# EasyEDA schematic Vehicle Accident Detection.json
TITLE: Sheet_1; REV: 1.0; Date: 2020-03-09; Sheet: 1/1; Drawn By: abhig0209; Company: Your Company
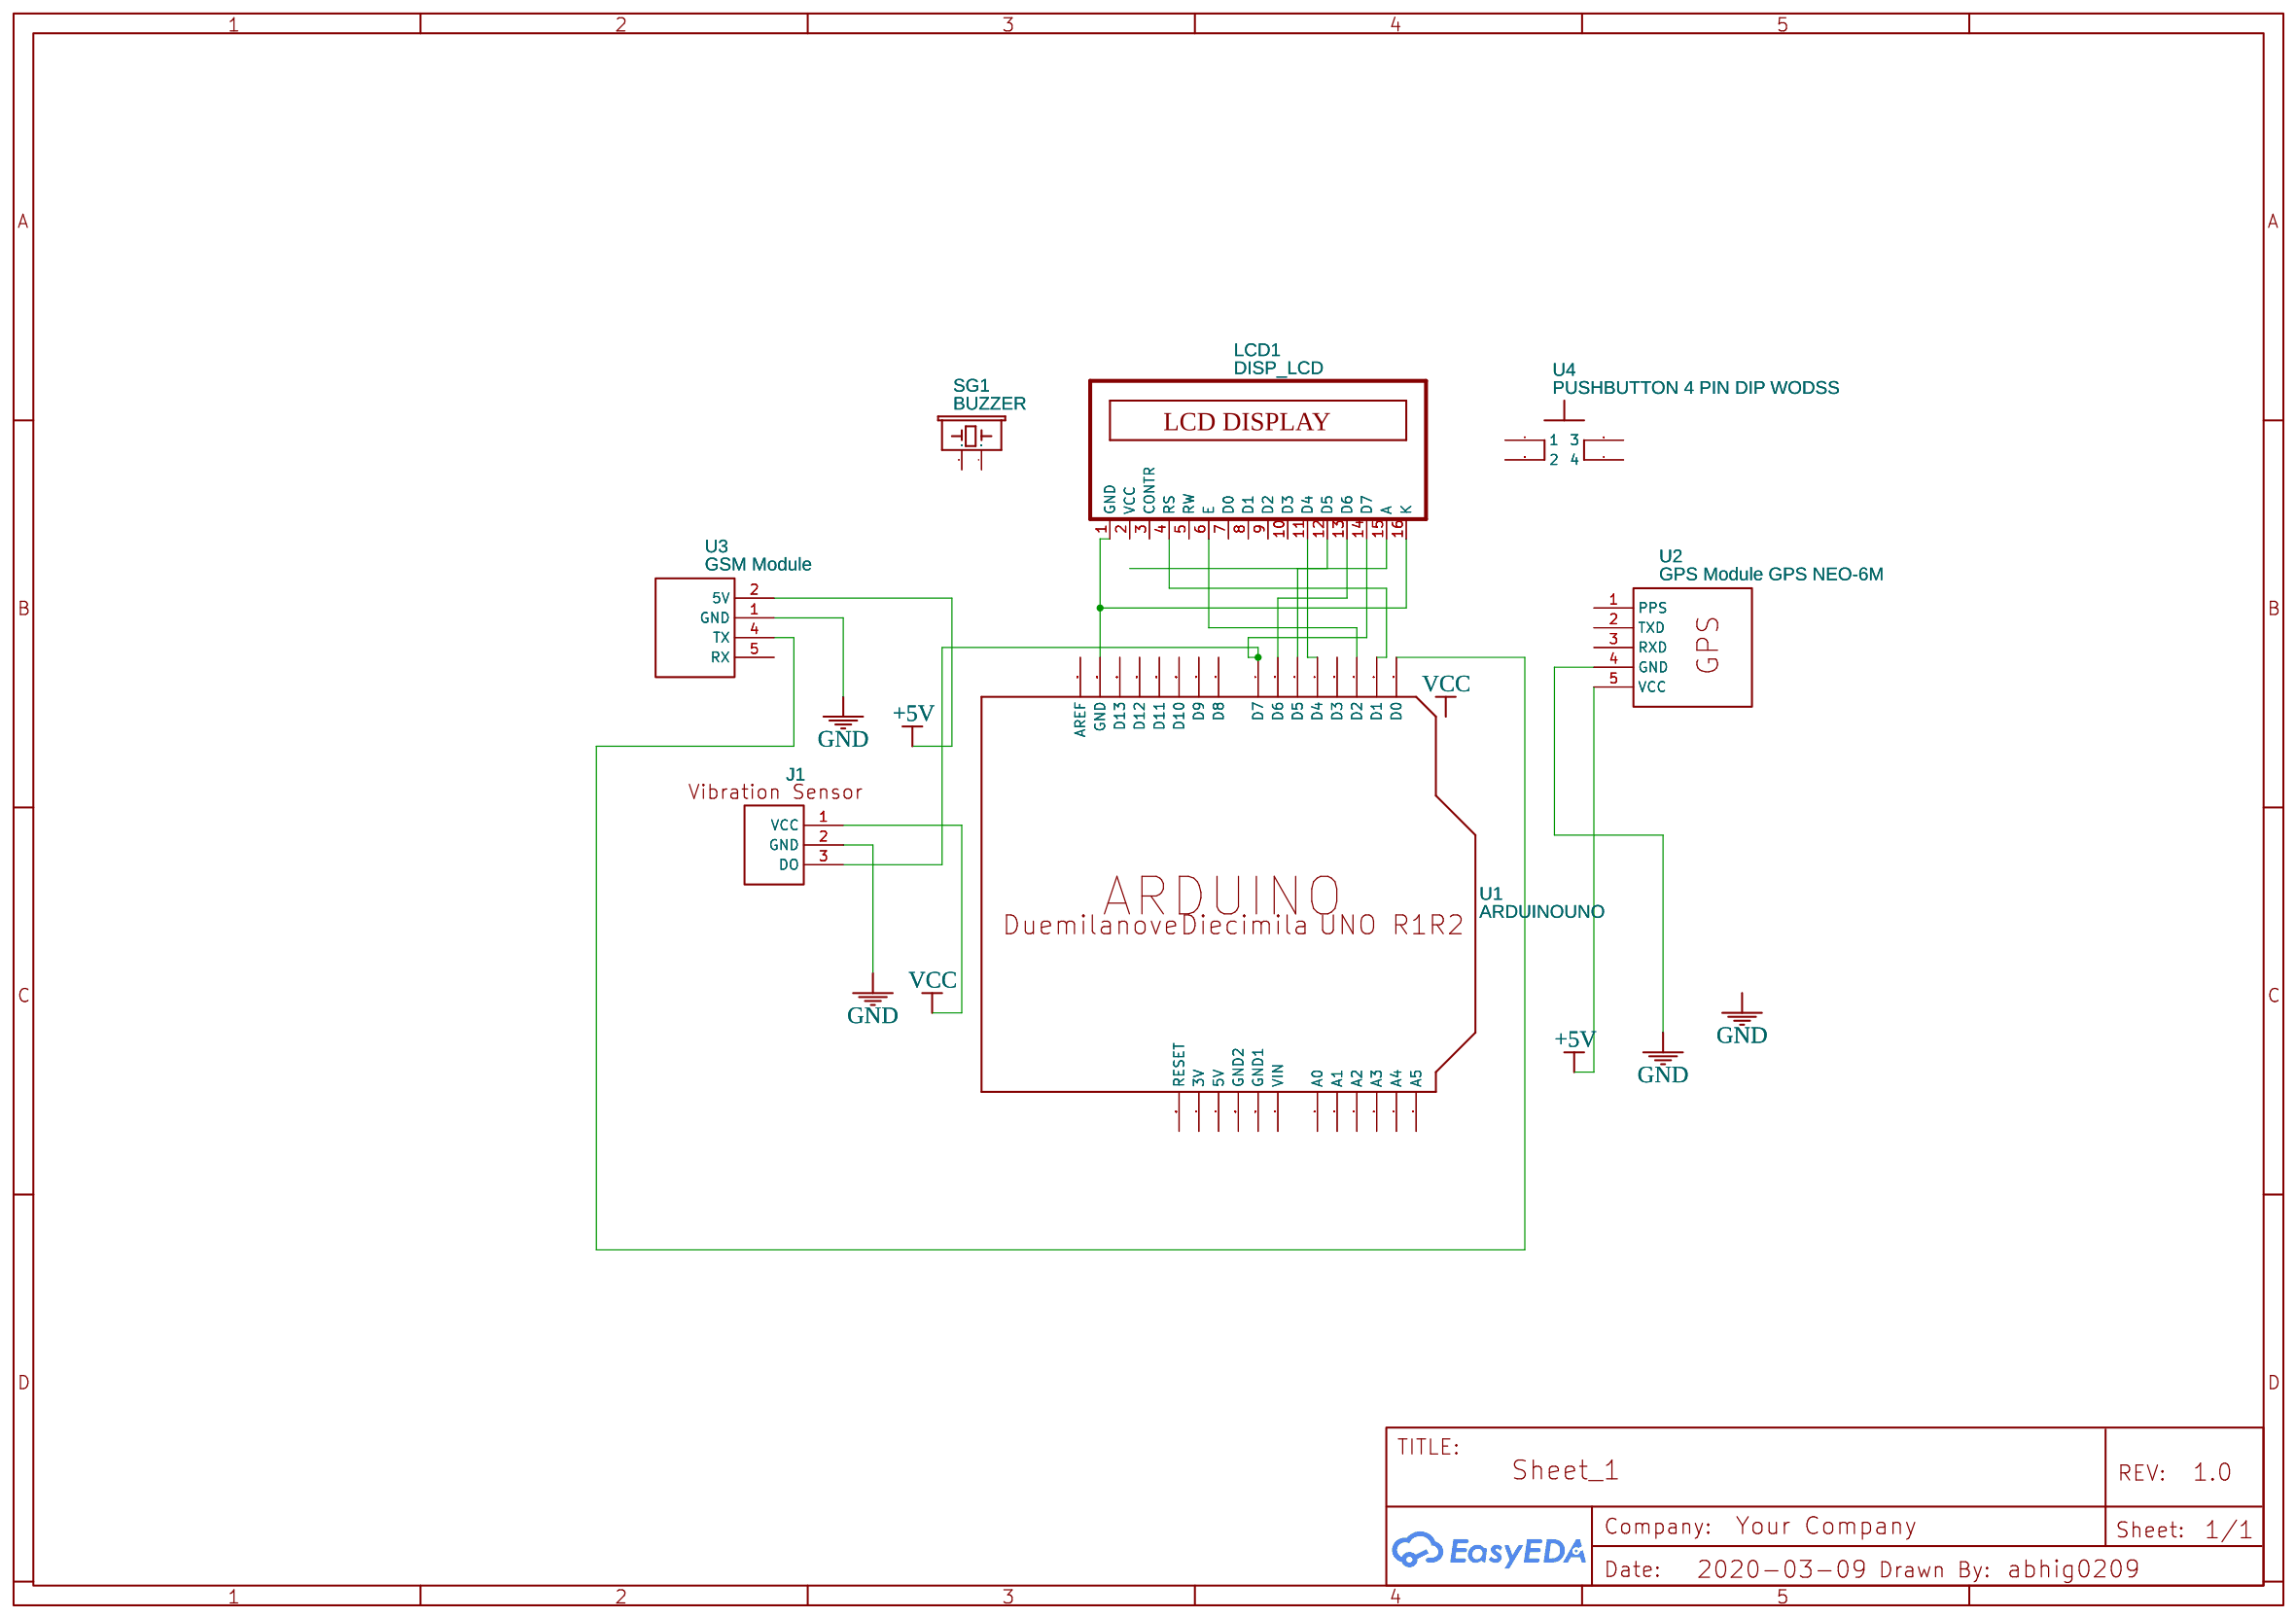
[diagram p0: schematic sheet]

## Parts
J1  Vibration_Sensor
LCD1  DISP_LCD  [DISP_LCD_4X20]
SG1  BUZZER  [BUZZER-12MM-NS-KIT]
U1  ARDUINOUNO  [ARDUINO]
U2  GPS Module GPS NEO-6M  [GPS MODULE GPS NEO-6M]
U3  GSM Module  [GSM MODULE]
U4  PUSHBUTTON 4 PIN DIP WODSS  [PUSH BUTTON 4 PIN DIP]

## Library data of the parts
J1 = Vibration_Sensor: Manufacturer Part: Vibration Sensor; Contributor: darwinenergy
LCD1 = DISP_LCD: Contributor: DangerousPrototype
SG1 = BUZZER: Contributor: SparkFun
U1 = ARDUINOUNO: Arduino DiecimilaDuemilanove; Contributor: Adafruit
U2 = GPS Module GPS NEO-6M: Contributor: sandersieglaff
U3 = GSM Module: Contributor: gkovacs81
U4 = PUSHBUTTON 4 PIN DIP WODSS: Manufacturer Part: Pushbutton; Contributor: elnino; Supplier: LAMINGTON

## Nets
+5V: U2.5(VCC) U3.2(5V)
GND: J1.2(GND) U2.4(GND) U3.1(GND)
VCC: J1.1(VCC)
Net-(J1-3): J1.3(DO) LCD1.14(D7) U1.D7
Net-(LCD1-1): LCD1.1(GND) LCD1.16(K) U1.GND
Net-(LCD1-4): LCD1.4(RS) U1.D1
Net-(LCD1-6): LCD1.6(E) U1.D2
Net-(LCD1-11): LCD1.11(D4) U1.D4
Net-(LCD1-12): LCD1.12(D5) U1.D5
Net-(LCD1-13): LCD1.13(D6) U1.D6
Net-(U1-D0): U1.D0 U3.4(TX)

Not connected (* = marked no-connect by the designer): LCD1 2(VCC) 3(CONTR) 5(RW) 7(D0) 8(D1) 9(D2) 10(D3) 15(A); SG1 +(1) -(2); U1 3V 5V A0 A1 A2 A3 A4 A5 AREF D3 D8 D9 D10 D11 D12 D13 GND1 GND2 RESET VIN; U2 1(PPS) 2(TXD) 3(RXD); U3 5(RX); U4 1 2 3 4
